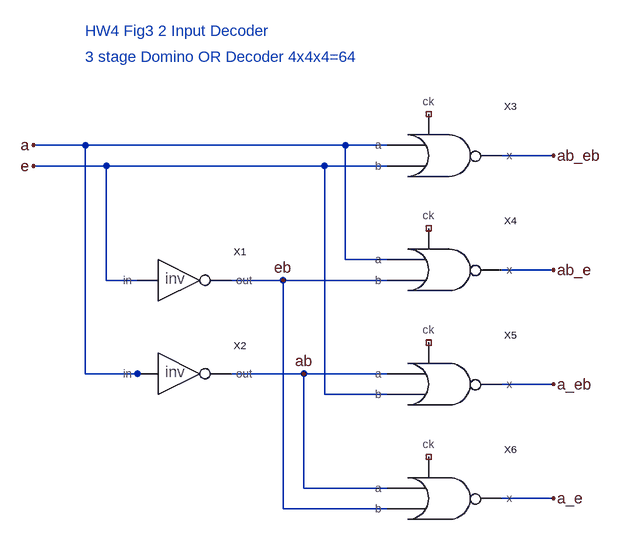
[diagram p0: schematic DECODER2_FDNOR.asc]
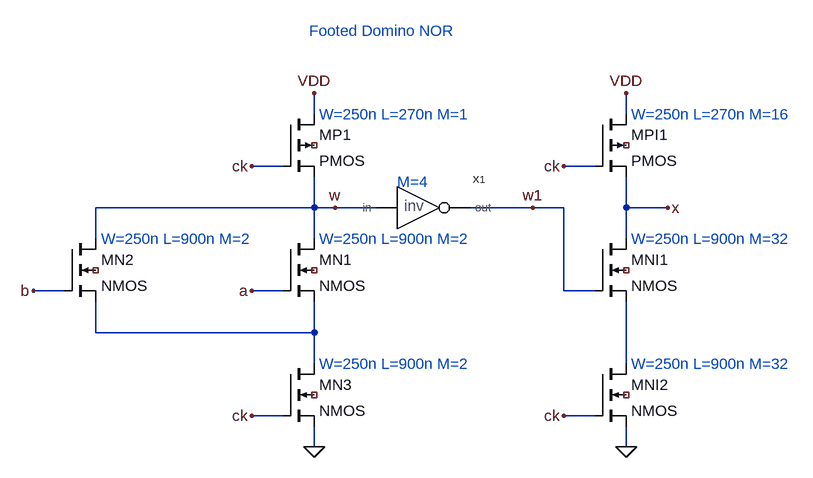
[diagram p1: sub-circuit fd_nor.asc]
DECODER2_FDNOR.asc, the LTspice schematic file:
Version 4
SHEET 1 880 972
WIRE -336 368 -416 368
WIRE 64 368 -336 368
WIRE 128 368 64 368
WIRE 384 384 304 384
WIRE -304 400 -416 400
WIRE 32 400 -304 400
WIRE 128 400 32 400
WIRE 64 544 64 368
WIRE 128 544 64 544
WIRE 384 560 304 560
WIRE -304 576 -304 400
WIRE -256 576 -304 576
WIRE -32 576 -112 576
WIRE 128 576 -32 576
WIRE -336 720 -336 368
WIRE -256 720 -336 720
WIRE -240 720 -256 720
WIRE 0 720 -112 720
WIRE 128 720 0 720
WIRE 384 736 304 736
WIRE 32 752 32 400
WIRE 128 752 32 752
WIRE 0 896 0 720
WIRE 128 896 0 896
WIRE 384 912 304 912
WIRE -32 928 -32 576
WIRE 128 928 -32 928
FLAG -416 368 a
FLAG -416 400 e
FLAG 384 384 ab_eb
FLAG 384 560 ab_e
FLAG 384 736 a_eb
FLAG 384 912 a_e
FLAG -32 576 eb
FLAG 0 720 ab
SYMBOL inv -160 576 R0
SYMATTR InstName X1
SYMBOL inv -160 720 R0
SYMATTR InstName X2
SYMBOL FD_NOR 192 384 R0
SYMATTR InstName X3
SYMBOL FD_NOR 192 560 R0
SYMATTR InstName X4
SYMBOL FD_NOR 192 736 R0
SYMATTR InstName X5
SYMBOL FD_NOR 192 912 R0
SYMATTR InstName X6
TEXT -336 192 Left 2 ;HW4 Fig3 2 Input Decoder
TEXT -336 232 Left 2 ;3 stage Domino OR Decoder 4x4x4=64

fd_nor.asc, the sub-circuit schematic file:
Version 4
SHEET 1 1140 680
WIRE 208 -128 208 -160
WIRE 688 -128 688 -160
WIRE 160 -48 112 -48
WIRE 640 -48 592 -48
WIRE 208 16 208 -32
WIRE 208 16 -128 16
WIRE 240 16 208 16
WIRE 304 16 240 16
WIRE 544 16 448 16
WIRE 592 16 544 16
WIRE 688 16 688 -32
WIRE 752 16 688 16
WIRE -128 64 -128 16
WIRE 208 64 208 16
WIRE 688 64 688 16
WIRE -176 144 -224 144
WIRE 160 144 112 144
WIRE 592 144 592 16
WIRE 640 144 592 144
WIRE -128 208 -128 160
WIRE 208 208 208 160
WIRE 208 208 -128 208
WIRE 208 256 208 208
WIRE 688 256 688 160
WIRE 160 336 112 336
WIRE 640 336 592 336
WIRE 208 384 208 352
WIRE 688 384 688 352
FLAG 112 -48 ck
FLAG 112 144 a
FLAG -224 144 b
FLAG 208 -160 VDD
FLAG 112 336 ck
FLAG 208 384 0
FLAG 240 16 w
FLAG 544 16 w1
FLAG 688 384 0
FLAG 592 336 ck
FLAG 592 -48 ck
FLAG 688 -160 VDD
FLAG 752 16 x
SYMBOL nmos4 -176 64 R0
SYMATTR InstName MN2
SYMBOL nmos4 160 64 R0
SYMATTR InstName MN1
SYMBOL pmos4 160 -128 R0
SYMATTR InstName MP1
SYMBOL nmos4 160 256 R0
SYMATTR InstName MN3
SYMBOL inv 400 16 R0
SYMATTR InstName X1
SYMBOL pmos4 640 -128 R0
SYMATTR InstName MPI1
SYMBOL nmos4 640 64 R0
SYMATTR InstName MNI1
SYMBOL nmos4 640 256 R0
SYMATTR InstName MNI2
TEXT 200 -256 Left 2 ;Footed Domino NOR
TEXT 216 -128 Left 2 ;W=250n L=270n M=1
TEXT 216 64 Left 2 ;W=250n L=900n M=2
TEXT -120 64 Left 2 ;W=250n L=900n M=2
TEXT 216 256 Left 2 ;W=250n L=900n M=2
TEXT 336 -24 Left 2 ;M=4
TEXT 696 -128 Left 2 ;W=250n L=270n M=16
TEXT 696 64 Left 2 ;W=250n L=900n M=32
TEXT 696 256 Left 2 ;W=250n L=900n M=32

The netlist it stands for:
* DECODER2_FDNOR.asc
XX1 e eb inv  ; pins in out
XX2 a ab inv  ; pins in out
XX3 a e NC_01 ab_eb fd_nor
XX4 a eb NC_02 ab_e fd_nor
XX5 ab e NC_03 a_eb fd_nor
XX6 ab eb NC_04 a_e fd_nor

* block symbol definitions
.subckt fd_nor a b ck x
MN2 w b N001 NC_01 NMOS
MN1 w a N001 NC_02 NMOS
MP1 VDD ck w NC_03 PMOS
MN3 N001 ck 0 NC_04 NMOS
XX1 w w1 inv  ; pins in out
MPI1 VDD ck x NC_05 PMOS
MNI1 x w1 N002 NC_06 NMOS
MNI2 N002 ck 0 NC_07 NMOS
* Footed Domino NOR
* W=250n L=270n M=1
* W=250n L=900n M=2
* W=250n L=900n M=2
* W=250n L=900n M=2
* M=4
* W=250n L=270n M=16
* W=250n L=900n M=32
* W=250n L=900n M=32
.ends fd_nor

.model NMOS NMOS
.model PMOS PMOS
.lib standard.mos
* HW4 Fig3 2 Input Decoder
* 3 stage Domino OR Decoder 4x4x4=64
.backanno
.end